# Altium schematic sheet EthernetPHY.SchDoc
size A3; SheetNumber: 8; SheetTotal: 22
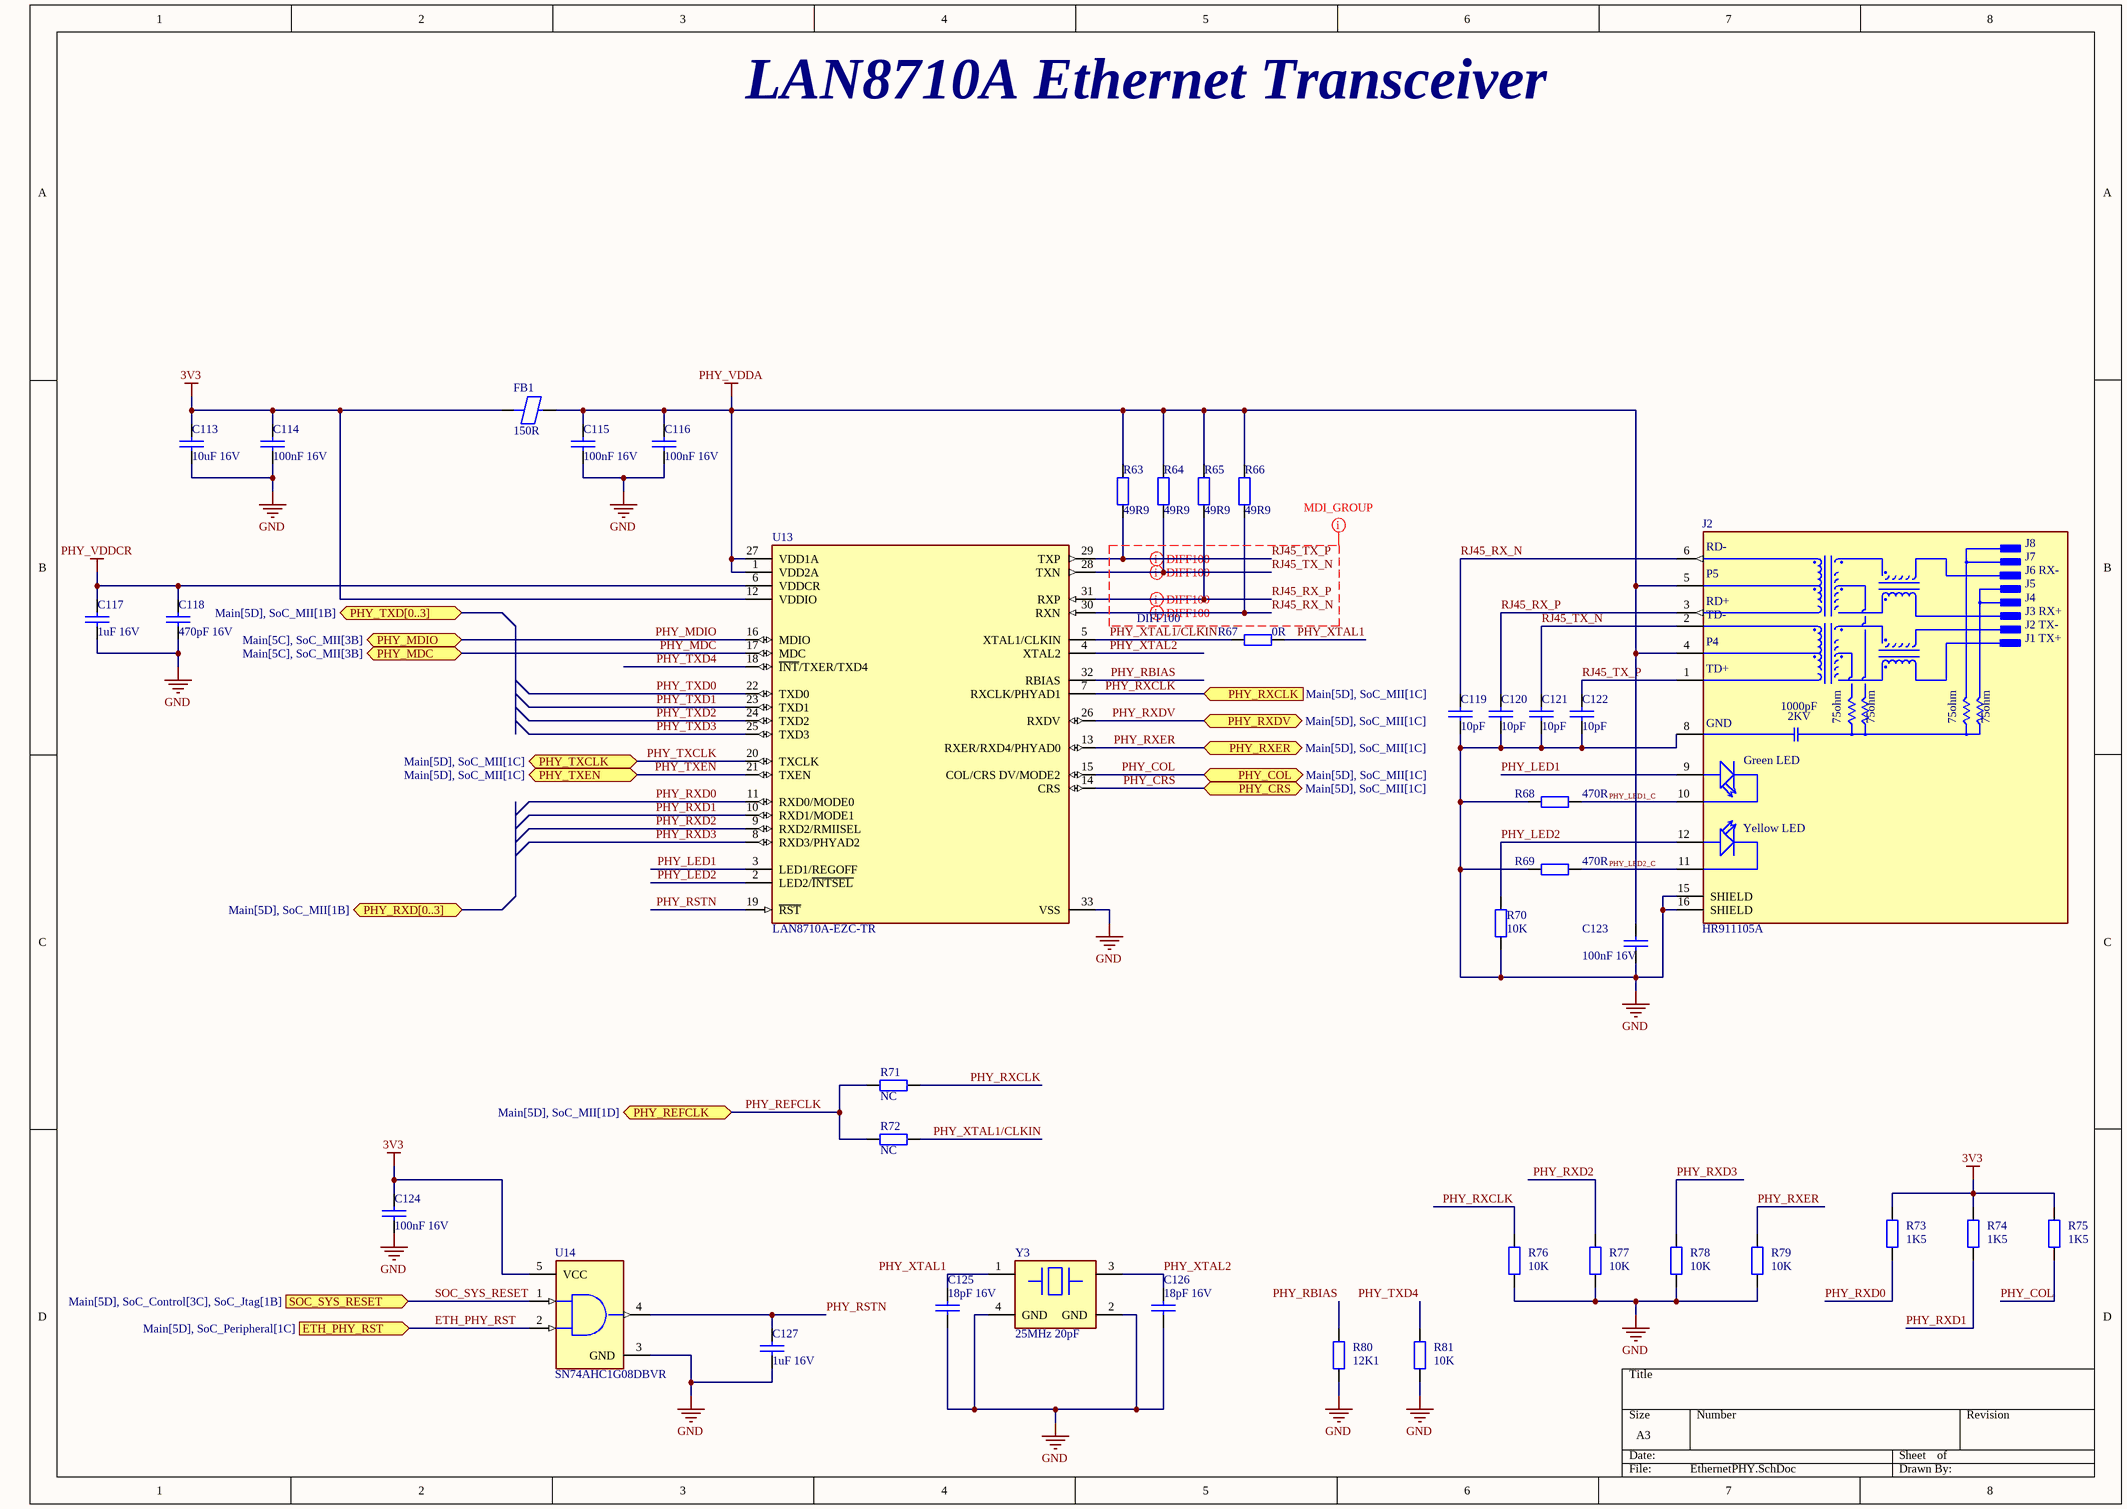
[diagram p0: EthernetPHY.SchDoc]

## Parts
C113  10uF 16V  [C_0603]
C114  100nF 16V  [C_0402]
C115  100nF 16V  [C_0402]
C116  100nF 16V  [C_0402]
C117  1uF 16V  [C_0603]
C118  470pF 16V  [C_0402]
C119  10pF  [C_0402]
C120  10pF  [C_0402]
C121  10pF  [C_0402]
C122  10pF  [C_0402]
C123  100nF 16V  [C_0402]
C124  100nF 16V  [C_0402]
C125  18pF 16V  [C_0402]
C126  18pF 16V  [C_0402]
C127  1uF 16V  [C_0603]
FB1  150R  [FB_0603]
J2  HR911105A  [HR911105A]
R63  49R9  [R_0402]
R64  49R9  [R_0402]
R65  49R9  [R_0402]
R66  49R9  [R_0402]
R67  0R  [R_0402]
R68  470R  [R_0402]
R69  470R  [R_0402]
R70  10K  [R_0402]
R71  NC  [R_0402]
R72  NC  [R_0402]
R73  1K5  [R_0402]
R74  1K5  [R_0402]
R75  1K5  [R_0402]
R76  10K  [R_0402]
R77  10K  [R_0402]
R78  10K  [R_0402]
R79  10K  [R_0402]
R80  12K1  [R_0402]
R81  10K  [R_0402]
U13  LAN8710A-EZC-TR  [FP-LAN8710A-EZC-TR-MFG]
U14  SN74AHC1G08DBVR  [FP-DBV0005A-MFG]
Y3  25MHz 20pF  [CRYSTAL_SMD3225-4P]

## Ports
ETH_PHY_RST (in, see Main[5D], SoC_Peripheral[1C]), PHY_COL (bidir, see Main[5D], SoC_MII[1C]), PHY_CRS (bidir, see Main[5D], SoC_MII[1C]), PHY_MDC (bidir, see Main[5C], SoC_MII[3B]), PHY_MDIO (bidir, see Main[5C], SoC_MII[3B]), PHY_REFCLK (bidir, see Main[5D], SoC_MII[1D]), PHY_RXCLK (in, see Main[5D], SoC_MII[1C]), PHY_RXD[0..3] (bidir, see Main[5D], SoC_MII[1B]), PHY_RXDV (bidir, see Main[5D], SoC_MII[1C]), PHY_RXER (bidir, see Main[5D], SoC_MII[1C]), PHY_TXCLK (bidir, see Main[5D], SoC_MII[1C]), PHY_TXD[0..3] (bidir, see Main[5D], SoC_MII[1B]), PHY_TXEN (bidir, see Main[5D], SoC_MII[1C]), SOC_SYS_RESET (in, see Main[5D], SoC_Control[3C], SoC_Jtag[1B])

## Nets
3V3: C113.1 C114.1 C124.1 FB1.1 R73.2 R74.2 R75.2 U13.12(VDDIO) U14.5(VCC)
GND: C113.2 C114.2 C115.2 C116.2 C117.2 C118.2 C119.2 C120.2 C121.2 C122.2 C123.2 C124.2 C125.1 C126.1 C127.2 J2.8(GND) J2.15(SHIELD) J2.16(SHIELD) R68.1 R69.1 R70.1 R76.1 R77.1 R78.1 R79.1 R80.1 R81.1 U13.33(VSS) U14.3(GND) Y3.2(GND) Y3.4(GND)
PHY_VDDA: C115.1 C116.1 C123.1 FB1.2 J2.4(P4) J2.5(P5) R63.2 R64.2 R65.2 R66.2 U13.1(VDD2A) U13.27(VDD1A)
PHY_VDDCR: C117.1 C118.1 U13.6(VDDCR)
ETH_PHY_RST: U14.2(B) ; port ETH_PHY_RST
PHY_COL: R75.1 U13.15(COL/CRS_DV/MODE2) ; port PHY_COL
PHY_CRS: U13.14(CRS) ; port PHY_CRS
PHY_LED1: J2.9(GA) U13.3(LED1/REGOFF)
PHY_LED1_C: J2.10(GC) R68.2
PHY_LED2: J2.12(YA) R70.2 U13.2(LED2/~{INTSEL})
PHY_LED2_C: J2.11(YC) R69.2
PHY_MDC: U13.17(MDC) ; port PHY_MDC
PHY_MDIO: U13.16(MDIO) ; port PHY_MDIO
PHY_RBIAS: R80.2 U13.32(RBIAS)
PHY_REFCLK: R71.2 R72.2 ; port PHY_REFCLK
PHY_RSTN: C127.1 U13.19(~{RST}) U14.4(Y)
PHY_RXCLK: R71.1 R76.2 U13.7(RXCLK/PHYAD1) ; port PHY_RXCLK
PHY_RXD0: R73.1 U13.11(RXD0/MODE0)
PHY_RXD1: R74.1 U13.10(RXD1/MODE1)
PHY_RXD2: R77.2 U13.9(RXD2/RMIISEL)
PHY_RXD3: R78.2 U13.8(RXD3/PHYAD2)
PHY_RXDV: U13.26(RXDV) ; port PHY_RXDV
PHY_RXER: R79.2 U13.13(RXER/RXD4/PHYAD0) ; port PHY_RXER
PHY_TXCLK: U13.20(TXCLK) ; port PHY_TXCLK
PHY_TXD0: U13.22(TXD0)
PHY_TXD1: U13.23(TXD1)
PHY_TXD2: U13.24(TXD2)
PHY_TXD3: U13.25(TXD3)
PHY_TXD4: R81.2 U13.18(~{INT}/TXER/TXD4)
PHY_TXEN: U13.21(TXEN) ; port PHY_TXEN
PHY_XTAL1: C125.2 R67.2 Y3.1(CRYSTAL_1)
PHY_XTAL1/CLKIN: R67.1 R72.1 U13.5(XTAL1/CLKIN)
PHY_XTAL2: C126.2 U13.4(XTAL2) Y3.3(CRYSTAL_2)
RJ45_RX_N: C119.1 J2.6(RD-) R66.1 U13.30(RXN)
RJ45_RX_P: C120.1 J2.3(RD+) R65.1 U13.31(RXP)
RJ45_TX_N: C121.1 J2.2(TD-) R64.1 U13.28(TXN)
RJ45_TX_P: C122.1 J2.1(TD+) R63.1 U13.29(TXP)
SOC_SYS_RESET: U14.1(A) ; port SOC_SYS_RESET

## Layout directives
net class MDI_GROUP: RJ45_RX_N, RJ45_RX_P, RJ45_TX_N, RJ45_TX_P
differential pair; differential pair class DIFF100: RJ45_RX_N, RJ45_RX_P, RJ45_TX_N, RJ45_TX_P

## Notes on the sheet
- LAN8710A Ethernet Transceiver
- (in symbol HR911105A) J8; J7; J6 RX-; J5; J4; J3 RX+; J2 TX-; J1 TX+; 1000pF; 2KV; 75ohm; Green LED; Yellow LED

## Library data of the parts
C113 C117 C127 = C_0603: Capacitor 0603 SMD
C114-C116 C118-C126 = C_0402: Capacitor 0402 SMD
FB1 = FB_0603: Ferrite Beads 0603 SMD
J2 = HR911105A: RJ45Receptacle 1 WithLED Plugin Ethernet Connectors / Modular Connectors (RJ45 RJ11) ROHS; Manufaacturer: HANRUN(Zhongshan HanRun Elec); Manufacturer Part Number: HR911105A; ComponentLink1Description: Datasheet Link; ComponentLink1URL: https://www.lcsc.com/datasheet/lcsc_datasheet_2409302333_HANRUN-Zhongshan-HanRun-Elec-HR911105A_C12074.pdf
R63-R81 = R_0402: Resistor 0402 SMD
U13 = CMP-0186-00334-2: IC TRANSCEIVER FULL 4/4 32QFN; Number of Channels: 1; Max Supply Current: 24.1mA; Min Supply Voltage: 1.62V; Simplex/Duplex: Full Duplex; Max Power Dissipation: 176mW; Number of LEDs: 4; Max Supply Voltage: 3.6V; Data Rate: 100Mbps; Number of Pins: 32; Package Quantity: 4000; Number of Transceivers: 1; Height: 0.95mm; Packaging: Tape and Reel; Case/Package: QFN; Min Operating Temperature: 0°C; Max Operating Temperature: 85°C; Lead Free: Lead Free; Length: 5.1mm; Width: 5.1mm
U14 = CMP-0859-00043-4: IC GATE AND 1CH 2-INP SOT23-5; Manufacturer: Texas Instruments; Number Of Outputs: 1; Nominal Supply Current: 1uA; Standoff Height: 0mm; Max Supply Voltage: 5.5V; Min Supply Voltage: 2V; Max Junction Temp: +150°C; Propagation Delay: 5.8ns; Number Of Inputs: 2; Logic Function Desc: Non-Inverting; Device Class L3: Logic Gates; Category: IC; ComponentLink2Description: Datasheet; Device Class L2: Logic ICs; RoHS: TRUE; Device Class L1: Integrated Circuits (ICs); Manufacturer Part Number: SN74AHC1G08DBVR; Temperature Range Low: -55°C; Number Of Circuits: 1; Automotive: No; Lead Free: Yes; Temperature Range High: +125°C; Digikey Description: IC GATE AND 1CH 2-INP SOT23-5; Ambient Temperature Range High: +125°C; Ambient Temperature Range Low: -55°C; Package: DBV0005A; Mouser Description: AND Gate 1-Element 2-IN CMOS 5-Pin SOT-23 AND Gate 1-Element 2-IN CMOS 5-Pin SOT-23 AND Gate 1-Element 2-IN CMOS 5-Pi...; ComponentLink2URL: http://www.ti.com/lit/ds/symlink/sn74ahc1g08.pdf; Height: 1.45mm; Temperature: -55°C to +125°C; Octopart: https://octopart.com/sn74ahc1g08dbvr-texas+instruments-464404
Y3 = X322525MSB4SI: 25MHz Surface Mount Crystal 20pF ±10ppm ±20ppm SMD3225-4P Crystals ROHS; Manufacturer: YXC Crystal Oscillators; Manufacturer Part Number: X322525MSB4SI; ComponentLink1Description: Datasheet Link; ComponentLink1URL: https://www.lcsc.com/datasheet/lcsc_datasheet_2411121006_YXC-Crystal-Oscillators-X322525MSB4SI_C13740.pdf